# EAGLE design interface (EAGLE 4.11)
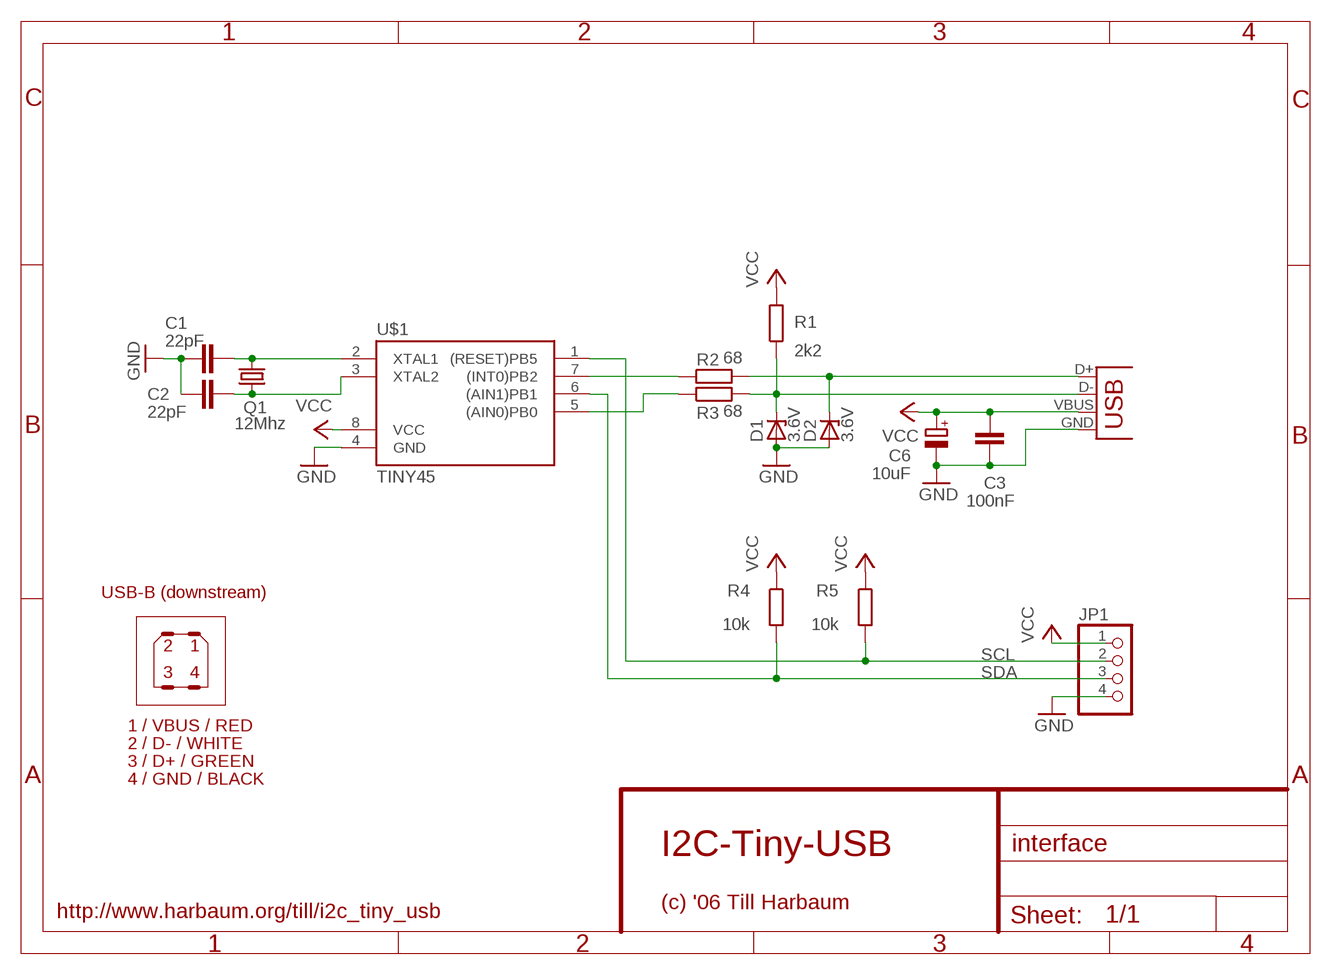
[diagram p0: schematic, sheet 1]

## Parts
C1  22pF  C-EU025-025X050  [C025-025X050]
C2  22pF  C-EU025-025X050  [C025-025X050]
C3  100nF  C-EU050-025X075  [C050-025X075]
C6  10uF  CPOL-EUTT2D5L  [TT2D5L]
D1  3.6V  ZENER-DIODEZD-10  [ZDIO-10]
D2  3.6V  ZENER-DIODEZD-10  [ZDIO-10]
JP1  PINHD-1X4  [1X04]
Q1  12Mhz  CRYTALHC49S  [HC49/S]
R1  2k2  R-EU_0207/10  [0207/10]
R2  68  R-EU_0207/10  [0207/10]
R3  68  R-EU_0207/10  [0207/10]
R4  10k  R-EU_0207/10  [0207/10]
R5  10k  R-EU_0207/10  [0207/10]
U$1  TINY45  [DIL08]
X1  USB-B-H  [USB-B-H]

## Nets
GND: C1.1 C2.1 C3.2 C6.- D1.A D2.A JP1.4 U$1.4(GND) X1.GND
N$1: C1.2 Q1.2 U$1.2(XTAL1)
N$2: C2.2 Q1.1 U$1.3(XTAL2)
N$3: D1.C R1.1 R2.2 X1.D-
N$6: D2.C R3.2 X1.D+
N$8: R2.1 U$1.5((AIN0)PB0)
N$9: R3.1 U$1.7((INT0)PB2)
SCL: JP1.2 R5.2 U$1.1((RESET)PB5)
SDA: JP1.3 R4.2 U$1.6((AIN1)PB1)
VCC: C3.1 C6.+ JP1.1 R1.2 R4.1 R5.1 U$1.8(VCC) X1.VBUS

## Notes on the sheet
- USB-B (downstream)
- 2 | 1
- 3 | 4
- 1 / VBUS / RED
- 2 / D- / WHITE
- 3 / D+ / GREEN
- 4 / GND / BLACK
- I2C-Tiny-USB
- (c) '06 Till Harbaum
- http://www.harbaum.org/till/i2c_tiny_usb

## Library data of the parts
C1-C3 = rcl:C-EU: CAPACITOR, European symbol
C6 = rcl:CPOL-EU: POLARIZED CAPACITOR, European symbol
D1 D2 = diode:ZENER-DIODE: Z-Diode
JP1 = pinhead:PINHD-1X4: PIN HEADER
Q1 = crystal:CRYTAL: CRYSTAL
R1-R5 = rcl:R-EU_: RESISTOR, European symbol
U$1 = avr-1:TINY45
X1 = con-usb:USB: USB Connectors

## Board
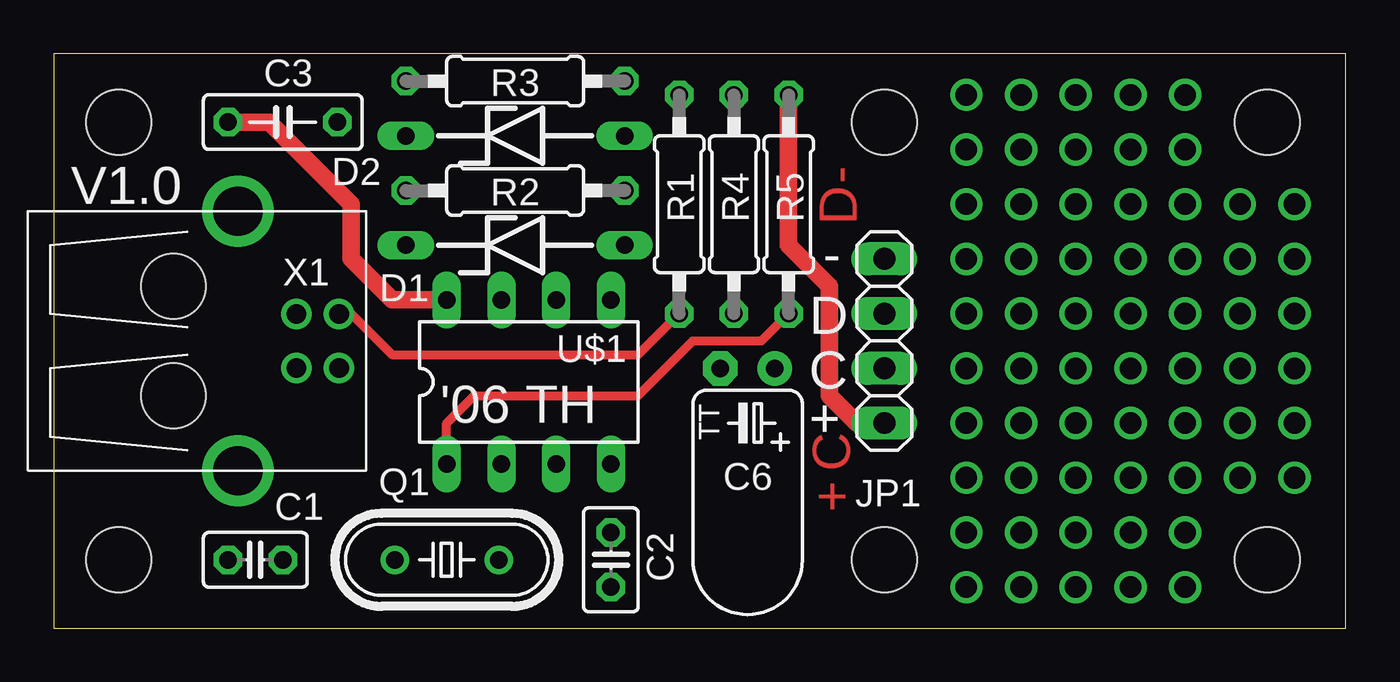
[diagram p1: board, top side]
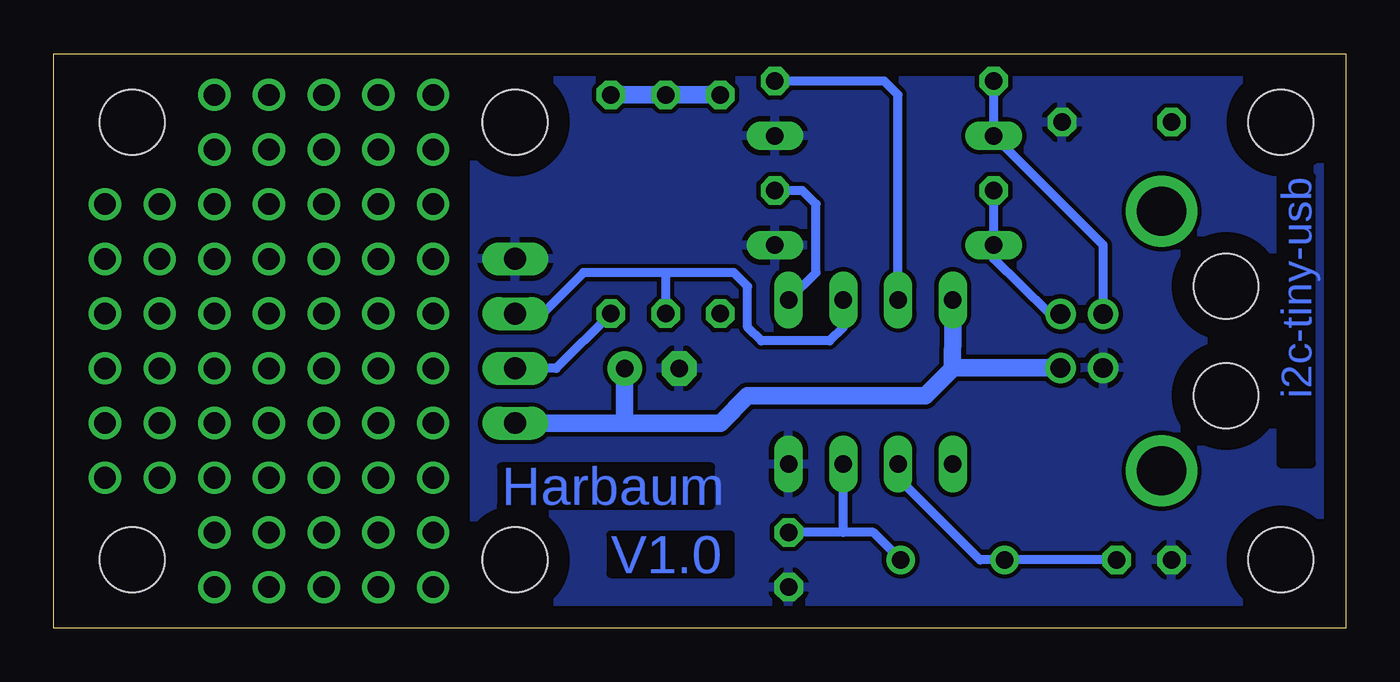
[diagram p2: board, bottom side, seen from below]

Size 59.99 x 26.66 mm. Coordinates in mm from the lower left corner, seen from the top.
Outline: 0,0 59.99,0 59.99,26.66 0,26.66 0,0
Copper layers (1*16): Top 0.035mm / dielectric 1.5mm / Bottom 0.035mm
Design rules "default": minimum track width 10mil, minimum drill 24mil, track to track 8mil, track to pad 8mil, pad to pad 8mil, via to via 8mil, smd to smd 8mil, copper to edge 40mil, drill to drill 8mil, minimum pad ring 10mil, minimum via ring 8mil, stop-mask expansion 4mil, vias tented up to drill 0mil, thermal gap 10mil
Holes 3 mm at 3.01,23.49 3.01,3.17 38.57,3.17 38.57,23.49 56.35,23.49 56.35,3.17 5.55,15.87 5.55,10.79

### Footprints (pad centres in the part's own frame; a part is rotated, then mirrored left to right if it is on the bottom)
C025-025X050 = drill 0.813 octagon: 1 -1.27,0; 2 1.27,0
C050-025X075 = drill 0.813 octagon: 1 -2.54,0; 2 2.54,0
TT2D5L = drill 0.813 pad 1.6 round: + -1.27,0 | drill 0.813 pad 1.6 octagon: - 1.27,0
ZDIO-10 = drill 0.813 long: A 5.08,0; C -5.08,0
1X04 = drill 1.016 long: 1 -3.81,0; 2 -1.27,0; 3 1.27,0; 4 3.81,0
HC49/S = drill 0.813 round: 1 -2.413,0; 2 2.413,0
0207/10 = drill 0.813 octagon: 1 -5.08,0; 2 5.08,0
DIL08 = drill 0.813 long: 1 -3.81,-3.81; 2 -1.27,-3.81; 3 1.27,-3.81; 4 3.81,-3.81; 5 3.81,3.81; 6 1.27,3.81; 7 -1.27,3.81; 8 -3.81,3.81
USB-B-H = drill 0.914 round: D+ 0,1.25; D- 1.981,1.25; GND 0,-1.25; VBUS 1.981,-1.25 | drill 2.286 round: P$1 -2.718,-6.02; P$2 -2.718,6.02

### Placement (x,y rotation side)
C1  9.36,3.17 0 top
C2  25.87,3.17 90 top
C3  10.63,23.49 0 top
C6  32.22,12.06 180 top
D1  21.42,17.77 0 top
D2  21.42,22.86 0 top
JP1  38.57,13.33 90 top
Q1  18.25,3.17 180 top
R1  29.04,19.68 90 top
R2  21.42,20.31 180 top
R3  21.42,25.39 180 top
R4  31.58,19.68 270 top
R5  34.12,19.68 270 top
U$1  22.06,11.43 0 top
X1  11.27,13.33 0 top

### Tracks (layer width: path | path; a pad name or v marks a point on that pad's centre or on a via)
GND
  pour Bottom: -0.17,26.66 40.48,26.66 40.48,-0.01 0.47,-0.01 -0.17,0.63
N$1
  Bottom 0.406: C1.2 15.71,3.17 | U$1.2 20.79,6.98 16.98,3.17 15.71,3.17 | 15.71,3.17 Q1.2
N$2
  Bottom 0.406: Q1.1 21.93,4.44 23.33,4.44 | 23.33,4.44 C2.2 | 23.33,4.44 U$1.3
N$3
  Top 0.406: X1.D- 13.83,14.58 15.71,12.7 27.14,12.7 R1.1
  Bottom 0.406: X1.D- 13.81,14.66 16.34,17.14 D1.C R2.2
N$4  (via drill 1)
  other vias: 42.38,4.44
N$5  (via drill 1)
  other vias: 42.38,19.68
N$6
  Bottom 0.406: X1.D+ 11.27,17.77 D2.C R3.2
N$7  (via drill 1)
  other vias: 42.38,24.76
N$8
  Bottom 0.406: U$1.5 24.6,16.5 24.6,19.68 25.23,20.31 R2.1
N$9
  Bottom 0.406: U$1.7 20.79,24.76 21.42,25.39 R3.1
N$10  (via drill 1)
  other vias: 44.92,17.14
N$11  (via drill 1)
  other vias: 44.92,19.68
N$12  (via drill 1)
  other vias: 44.92,24.76
N$13  (via drill 1)
  other vias: 47.46,4.44
N$14  (via drill 1)
  other vias: 47.46,19.68
N$15  (via drill 1)
  other vias: 47.46,24.76
N$16  (via drill 1)
  other vias: 50,17.14
N$17  (via drill 1)
  other vias: 52.54,19.68
N$18  (via drill 1)
  other vias: 50,24.76
N$19  (via drill 1)
  other vias: 44.92,22.22
N$20  (via drill 1)
  other vias: 47.46,22.22
N$21  (via drill 1)
  other vias: 50,22.22
N$22  (via drill 1)
  other vias: 52.54,24.76
N$23  (via drill 1)
  other vias: 52.54,22.22
N$24  (via drill 1)
  other vias: 57.62,9.52
N$25  (via drill 1)
  other vias: 57.62,19.68
N$26  (via drill 1)
  other vias: 55.08,19.68
N$27  (via drill 1)
  other vias: 55.08,9.52
N$28  (via drill 1)
  other vias: 57.62,17.14
N$29  (via drill 1)
  other vias: 57.62,14.6
N$30  (via drill 1)
  other vias: 55.08,14.6
N$31  (via drill 1)
  other vias: 55.08,12.06
N$32  (via drill 1)
  other vias: 57.62,12.06
N$33  (via drill 1)
  other vias: 57.62,6.98
N$34  (via drill 1)
  other vias: 55.08,6.98
N$35  (via drill 1)
  other vias: 52.54,4.44
N$36  (via drill 1)
  other vias: 55.08,17.14
N$37  (via drill 1)
  other vias: 52.54,17.14
N$38  (via drill 1)
  other vias: 50,19.68
N$39  (via drill 1)
  other vias: 42.38,22.22
N$40  (via drill 1)
  other vias: 42.38,17.14
N$41  (via drill 1)
  other vias: 42.38,14.6
N$42  (via drill 1)
  other vias: 42.38,12.06
N$43  (via drill 1)
  other vias: 42.38,9.52
N$44  (via drill 1)
  other vias: 42.38,6.98
N$45  (via drill 1)
  other vias: 42.38,1.9
N$46  (via drill 1)
  other vias: 44.92,1.9
N$47  (via drill 1)
  other vias: 44.92,4.44
N$48  (via drill 1)
  other vias: 44.92,6.98
N$49  (via drill 1)
  other vias: 44.92,9.52
N$50  (via drill 1)
  other vias: 44.92,12.06
N$51  (via drill 1)
  other vias: 44.92,14.6
N$52  (via drill 1)
  other vias: 47.46,17.14
N$53  (via drill 1)
  other vias: 47.46,14.6
N$54  (via drill 1)
  other vias: 47.46,12.06
N$55  (via drill 1)
  other vias: 47.46,9.52
N$56  (via drill 1)
  other vias: 47.46,6.98
N$57  (via drill 1)
  other vias: 47.46,1.9
N$58  (via drill 1)
  other vias: 50,1.9
N$59  (via drill 1)
  other vias: 50,4.44
N$60  (via drill 1)
  other vias: 50,6.98
N$61  (via drill 1)
  other vias: 50,9.52
N$62  (via drill 1)
  other vias: 50,12.06
N$63  (via drill 1)
  other vias: 50,14.6
N$64  (via drill 1)
  other vias: 52.54,14.6
N$65  (via drill 1)
  other vias: 52.54,12.06
N$66  (via drill 1)
  other vias: 52.54,9.52
N$67  (via drill 1)
  other vias: 52.54,6.98
N$68  (via drill 1)
  other vias: 52.54,1.9
SCL
  Top 0.406: U$1.1 18.25,9.52 19.52,10.79 27.14,10.79 29.68,13.33 32.85,13.33 R5.2
  Bottom 0.406: R5.2 36.66,12.06 JP1.2
SDA
  Bottom 0.406: 31.58,16.5 R4.2 | 31.58,16.5 28.41,16.5 27.77,15.87 27.77,13.97 27.14,13.33 23.96,13.33 23.33,13.97 U$1.6 | 31.58,16.5 35.39,16.5 37.3,14.6 JP1.3
VCC
  Top 0.813: C3.1 10,23.49 13.81,19.68 13.81,17.14 15.71,15.24 U$1.8 | R5.1 34.12,17.77 36.03,15.87 36.03,10.79 37.3,9.52 JP1.1
  Bottom 0.813: R1.2 R4.1 R5.1 | X1.VBUS 18.25,12.08 | 18.25,12.08 18.27,12.08 18.25,13.97 U$1.8 | 33.49,9.52 JP1.1 | 33.49,9.52 29.04,9.52 27.77,10.79 19.52,10.79 18.25,12.06 18.25,12.08 | 33.49,9.52 C6.+

### Text on the board
Top: - | D | C | +
Bottom: i2c-tiny-usb | Harbaum | V1.0
tNames: V1.0 | - | D | C | '06 TH | +